# Altium schematic sheet ATA-PAM-A.SchDoc
size B; SheetNumber: 0; SheetTotal: 0
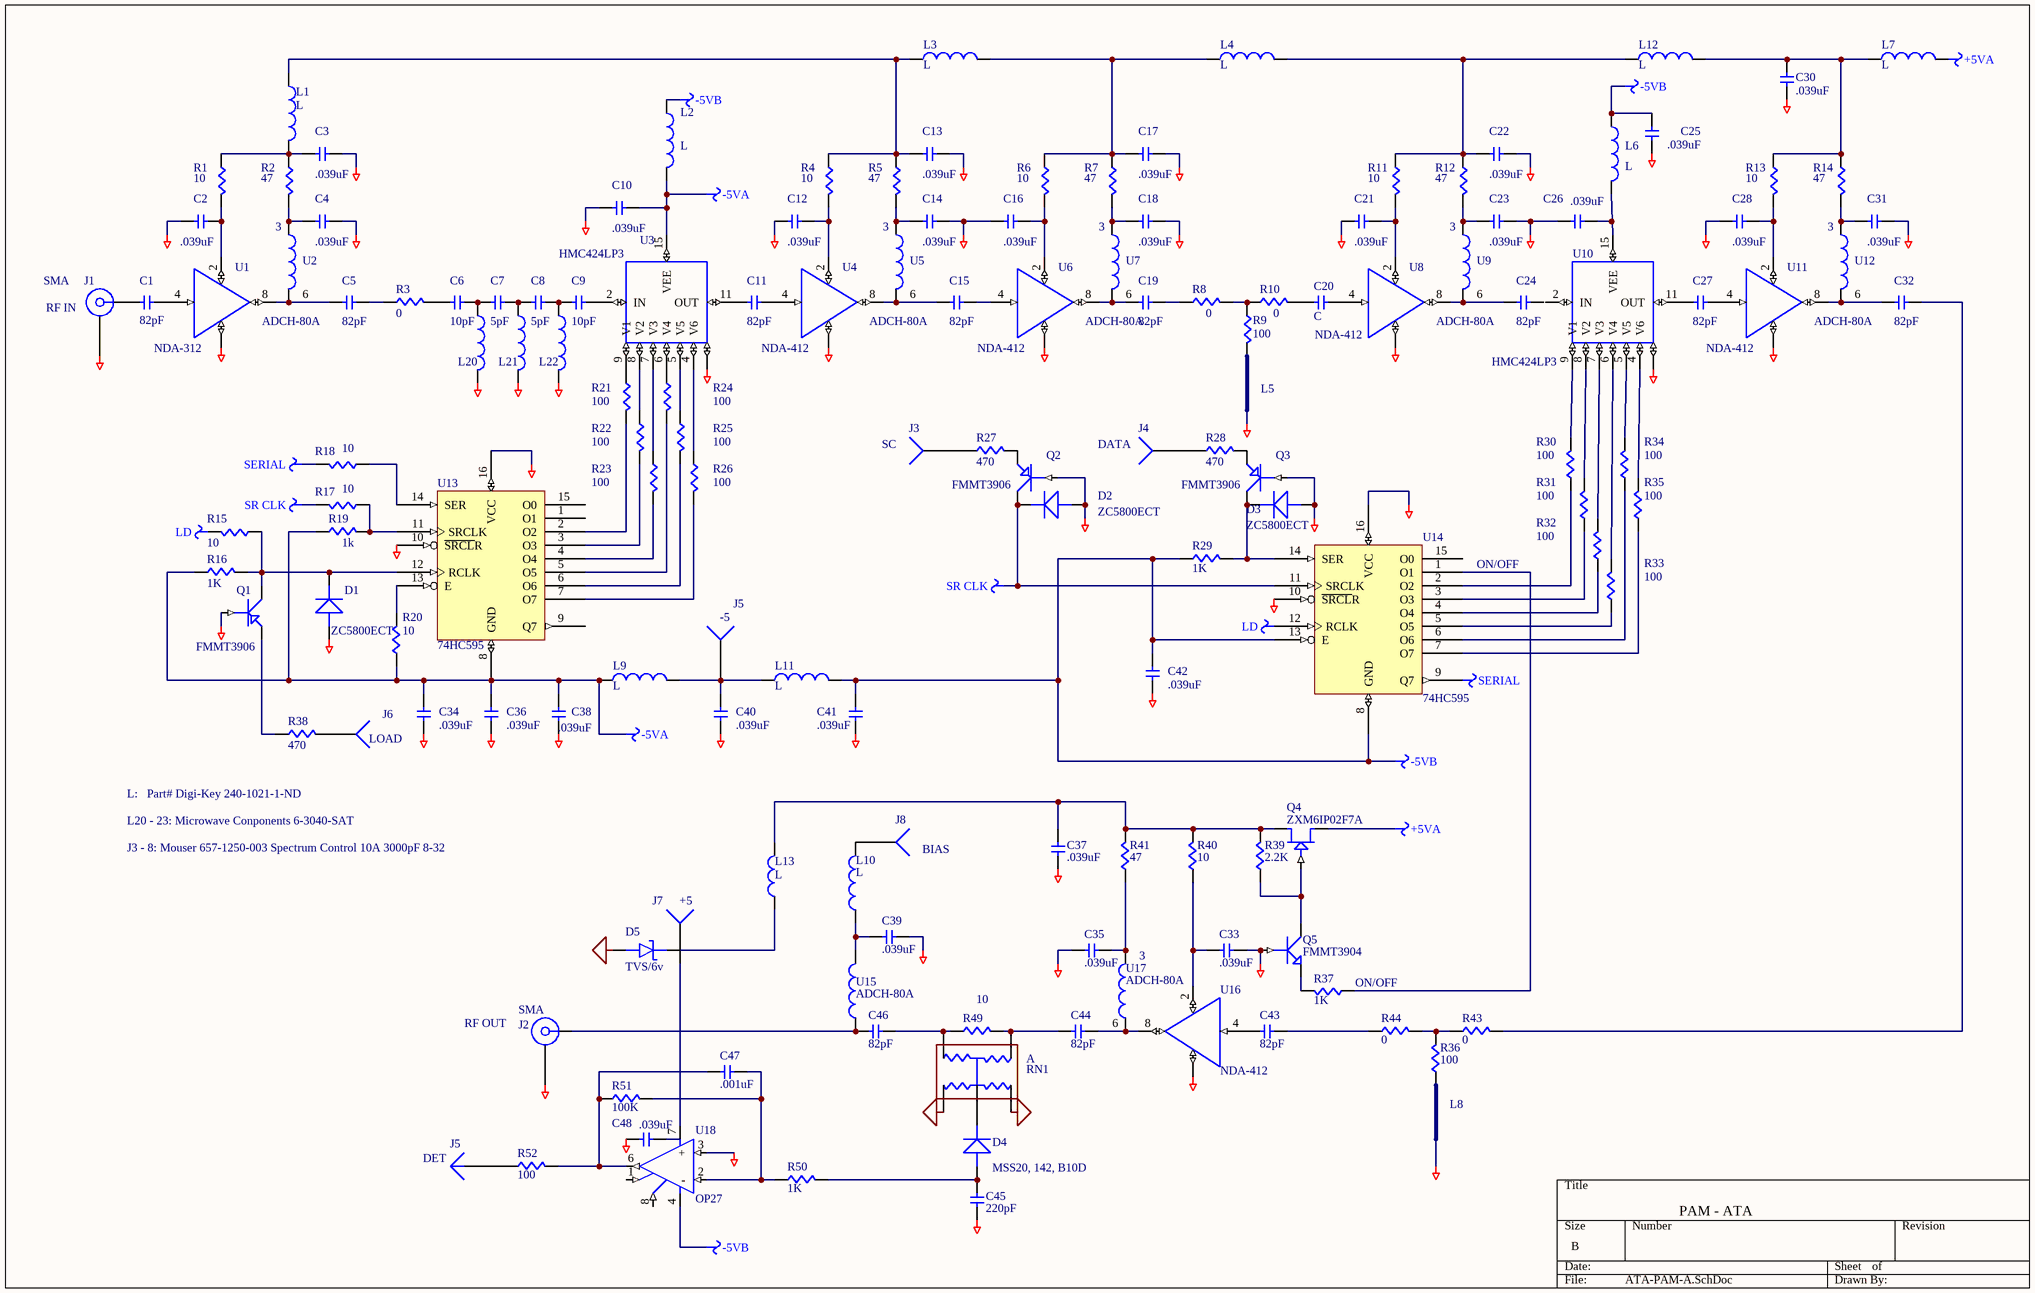
[diagram p0: ATA-PAM-A.SchDoc]

## Parts
(Parts that share a designator on the sheet are numbered #1, #2 ... from top to bottom, then left to right.)
C1  82pF
C2  .039uF
C3  .039uF
C4  .039uF
C5  82pF
C6  10pF
C7  5pF
C8  5pF
C9  10pF
C10  .039uF
C11  82pF
C12  .039uF
C13  .039uF
C14  .039uF
C15  82pF
C16  .039uF
C17  .039uF
C18  .039uF
C19  82pF
C20  C
C21  .039uF
C22  .039uF
C23  .039uF
C24  82pF
C25  .039uF
C26  .039uF
C27  82pF
C28  .039uF
C30  .039uF
C31  .039uF
C32  82pF
C33  .039uF
C34  .039uF
C35  .039uF
C36  .039uF
C37  .039uF
C38  .039uF
C39  .039uF
C40  .039uF
C41  .039uF
C42  .039uF
C43  82pF
C44  82pF
C45  220pF
C46  82pF
C47  .001uF
C48  .039uF
D1  ZC5800ECT
D2  ZC5800ECT
D3  ZC5800ECT
D4  MSS20, 142, B10D
D5  TVS/6v
J1  SMA
J2  SMA
J3  SC
J4  DATA
J5#1  -5
J5#2  DET
J7  +5
J8  BIAS
L1  L
L2  L
L3  L
L4  L
L6  L
L7  L
L9  L
L10  L
L11  L
L12  L
L13  L
L20  (no value)
L21  (no value)
L22  (no value)
LOAD  J6
Q1  FMMT3906
Q2  FMMT3906
Q3  FMMT3906
Q4  ZXM6IP02F7A
Q5  FMMT3904
R1  10
R2  47
R3  0
R4  10
R5  47
R6  10
R7  47
R8  0
R9  100
R10  0
R11  10
R12  47
R13  10
R14  47
R15  10
R16  1K
R17  10
R18  10
R19  1k
R20  10
R21  100
R22  100
R23  100
R24  100
R25  100
R26  100
R27  470
R28  470
R29  1K
R30  100
R31  100
R32  100
R33  100
R34  100
R35  100
R36  100
R37  1K
R38  470
R39  2.2K
R40  10
R41  47
R43  0
R44  0
R49  10
R50  1K
R51  100K
R52  100
RN1  A
U1  NDA-312
U2  ADCH-80A
U3  HMC424LP3
U4  NDA-412
U5  ADCH-80A
U6  NDA-412
U7  ADCH-80A
U8  NDA-412
U9  ADCH-80A
U10  HMC424LP3
U11  NDA-412
U12  ADCH-80A
U13  74HC595  [DIP16]
U14  74HC595  [DIP16]
U15  ADCH-80A
U16  NDA-412
U17  ADCH-80A
U18  OP27  [DIP8]

## Nets
+5VA: L7.2 Q4.D
-5VA: C10.1 C34.1 C36.1 C38.1 L2.2 L9.1 R16.1 R19.1 R20.1 U3.15(VEE) U13.8(GND)
-5VB: C25.1 C41.1 C42.1 L2.1 L6.1 L11.2 R29.1 U14.8(GND) U14.13(E) U18.4(MINUS_V)
GND: RN1.3 RN1.4 U13.8(GND) U14.8(GND)
LD: R15.2 U14.12(RCLK)
NetC2_2: C2.2 C3.2 C4.2 C10.2 C12.2 C13.2 C14.2 C16.2 C17.2 C18.2 C21.2 C22.2 C23.2 C25.2 C26.2 C28.2 C30.2 C31.2 C33.2 C34.2 C35.2 C36.2 C37.2 C38.2 C39.2 C40.2 C41.2 C42.2 C45.2 C48.2 D1.1 D2.1 D3.1 J1.2 J2.2 L20.2 L21.2 L22.2 Q1.2 Q2.2 Q3.2 Q5.2 R9.2 R36.2 U1.?1 U3.?1 U4.?1 U6.?1 U8.?1 U10.?1 U11.?1 U13.10(~{SRCL}R) U13.16(VCC) U14.10(~{SRCL}R) U14.16(VCC) U16.?1 U18.3(+)
SERIAL: R18.2 U14.9(Q7)
SGND: D5.1
SR CLK: D2.2 Q2.3 R17.2 U14.11(SRCLK)
VCC: U13.16(VCC) U14.16(VCC)
NetC1_1: C1.1 J1.1
NetC1_2: C1.2 U1.4
NetC2_1: C2.1 R1.2 U1.2
NetC3_1: C3.1 L1.2 R1.1 R2.1
NetC4_1: C4.1 R2.2 U2.1
NetC5_1: C5.1 U1.8 U2.2
NetC5_2: C5.2 R3.1
NetC6_1: C6.1 R3.2
NetC6_2: C6.2 C7.1 L20.1
NetC7_2: C7.2 C8.1 L21.1
NetC8_2: C8.2 C9.1 L22.1
NetC9_2: C9.2 U3.2(IN)
NetC11_1: C11.1 U3.11(OUT)
NetC11_2: C11.2 U4.4
NetC12_1: C12.1 R4.2 U4.2
NetC13_1: C13.1 L1.1 L3.1 R4.1 R5.1
NetC14_1: C14.1 R5.2 U5.1
NetC15_1: C15.1 U4.8 U5.2
NetC15_2: C15.2 U6.4
NetC16_1: C16.1 R6.2 U6.2
NetC17_1: C17.1 L3.2 L4.1 R6.1 R7.1
NetC18_1: C18.1 R7.2 U7.1
NetC19_1: C19.1 U6.8 U7.2
NetC19_2: C19.2 R8.1
NetC20_1: C20.1 R10.2
NetC20_2: C20.2 U8.4
NetC21_1: C21.1 R11.2 U8.2
NetC22_1: C22.1 L4.2 L12.1 R11.1 R12.1
NetC23_1: C23.1 R12.2 U9.1
NetC24_1: C24.1 U8.8 U9.2
NetC27_1: C27.1 U10.11(OUT)
NetC28_1: C28.1 R13.2 U11.2
NetC30_1: C30.1 L7.1 L12.2 R13.1 R14.1
NetC31_1: C31.1 R14.2 U12.1
NetC32_1: C32.1 U11.8 U12.2
NetC32_2: C32.2 R43.1
NetC33_1: C33.1 R40.2 U16.2
NetC35_1: C35.1 R41.2 U17.1
NetC37_1: C37.1 L13.2 Q4.S R39.1 R40.1 R41.1
NetC39_1: C39.1 L10.2 U15.1
NetC40_1: C40.1 J5#1.A L9.2 L11.1
NetC43_1: C43.1 R44.2
NetC43_2: C43.2 U16.4
NetC44_1: C44.1 U16.8 U17.2
NetC44_2: C44.2 R49.1 RN1.1
NetC45_1: C45.1 D4.1 R50.1
NetC46_1: C46.1 R49.2 RN1.2
NetC46_2: C46.2 J2.1 U15.2
NetC47_1: C47.1 R50.2 R51.1 U18.2(-)
NetC47_2: C47.2 R51.2 R52.1 U18.6(OUTPUT)
NetD1_2: D1.2 Q1.3 R15.1 R16.2 U13.12(RCLK)
NetD3_2: D3.2 Q3.3 R29.2 U14.14(SER)
NetD4_2: D4.2 RN1.5
NetD5_2: D5.2 L13.1
NetJ3_A: J3.A R27.1
NetJ4_A: J4.A R28.1
NetJ5#2_A: J5#2.A R52.2
NetJ7_1: J7.1(A) U18.7(PLUS_V)
NetJ8_1: J8.1(A) L10.1
NetL6_2: L6.2 U10.15(VEE)
NetQ1_1: Q1.1 R38.1
NetQ2_1: Q2.1 R27.2
NetQ3_1: Q3.1 R28.2
NetQ4_G: Q4.G Q5.3 R39.2
NetQ5_1: Q5.1 R37.1
NetR8_2: R8.2 R9.1 R10.1
NetR17_1: R17.1 R19.2 U13.11(SRCLK)
NetR18_1: R18.1 U13.14(SER)
NetR20_2: R20.2 U13.13(E)
NetR21_1: R21.1 U3.9(V1)
NetR21_2: R21.2 U13.2(O2)
NetR22_1: R22.1 U3.8(V2)
NetR22_2: R22.2 U13.3(O3)
NetR23_1: R23.1 U3.7(V3)
NetR23_2: R23.2 U13.4(O4)
NetR24_1: R24.1 U3.6(V4)
NetR24_2: R24.2 U13.5(O5)
NetR25_1: R25.1 U3.5(V5)
NetR25_2: R25.2 U13.6(O6)
NetR26_1: R26.1 U3.4(V6)
NetR26_2: R26.2 U13.7(O7)
NetR30_1: R30.1 U14.2(O2)
NetR30_2: R30.2 U10.9(V1)
NetR31_1: R31.1 U14.3(O3)
NetR31_2: R31.2 U10.8(V2)
NetR32_1: R32.1 U14.4(O4)
NetR32_2: R32.2 U10.7(V3)
NetR33_1: R33.1 U14.5(O5)
NetR33_2: R33.2 U10.6(V4)
NetR34_1: R34.1 U14.6(O6)
NetR34_2: R34.2 U10.5(V5)
NetR35_1: R35.1 U14.7(O7)
NetR35_2: R35.2 U10.4(V6)
NetR36_1: R36.1 R43.2 R44.1
NetR37_2: R37.2 U14.1(O1)

Not connected (* = marked no-connect by the designer): C24 2; C26 1; C27 2; C48 1; LOAD A; R38 2; U10 2(IN); U11 4; U13 1(O1) 9(Q7) 15(O0); U14 15(O0); U18 1(COMPENSATION_1) 8(COMPENSATION_2)

## Notes on the sheet
- (near U2) 3
- (near U5) 3
- (near U7) 3
- (near U9) 3
- (near U12) 3
- (near U2) 6
- (near U5) 6
- 6
- (near U9) 6
- (near U12) 6
- (near J1) RF IN
- L5
- ON/OFF
- L:   Part# Digi-Key 240-1021-1-ND
- L20 - 23: Microwave Conponents 6-3040-SAT
- J3 - 8: Mouser 657-1250-003 Spectrum Control 10A 3000pF 8-32
- (near U17) 3
- (near J2) RF OUT
- (near U17) 6
- (near R37) ON/OFF
- (near R36) L8
- PAM - ATA

## Library data of the parts
C1-C19 C21-C28 C30-C48 = C
D1-D4 = DIODE
D5 = ZENER*
J1 J2 = BNC
J3 J4 J5#1 J7 J8 LOAD = CONNECTOR COAX-F
J5#2 = CONNECTOR COAX-M
L1-L4 L6 L7 L9-L12 L20-L22 U2 U5 U7 U9 U12 U15 U17 = INDUCTOR
L13 = L: Chip Inductors; Text Field1: Coil Craft
Q1-Q3 = PNP
Q4 = JFET N
Q5 = NPN
R1-R41 R43 R44 R49-R52 = R: Resistor; 1%: *
RN1 = ALUMINA
U4 U6 U8 U11 U16 = NDA-312
U13 U14 = 74LS595
U18 = 10104: High Speed, Low Power, Wide Supply Range Amp.; AD817AN: *; AD817AR: *